# EAGLE design BandpassedGainAmpThruhole (EAGLE 9.6.2)
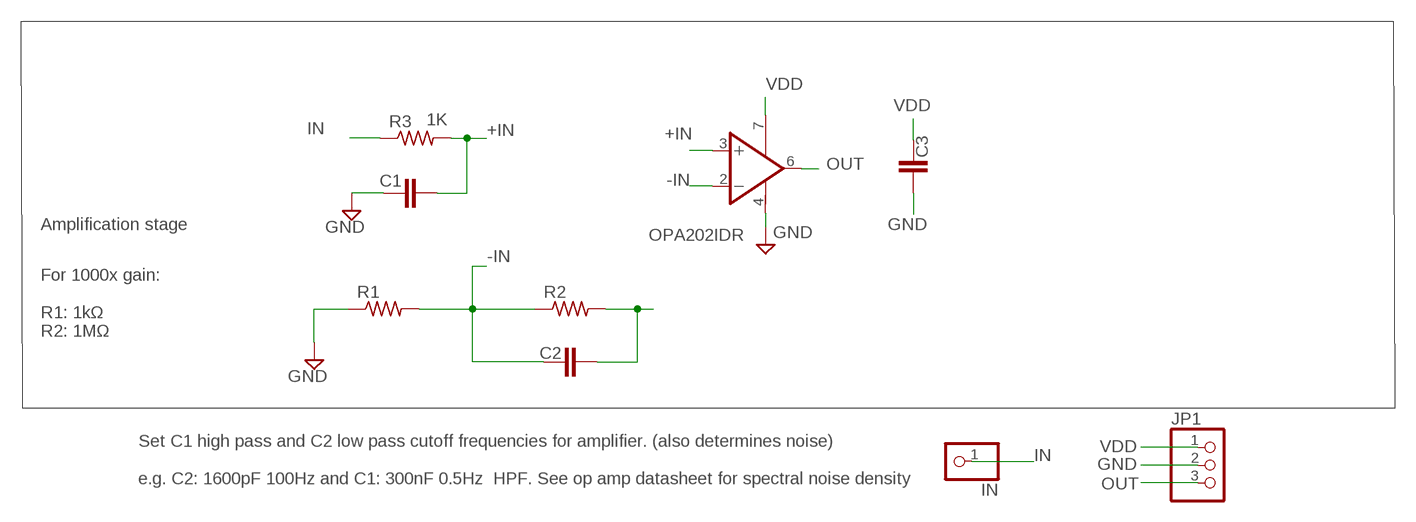
[diagram p0: schematic, sheet 1]

## Parts
C1  C2.5/2  [C2.5-2]
C2  C2.5/2  [C2.5-2]
C3  C2.5/2  [C2.5-2]
IN  PINHD-1X1  [1X01]
JP1  PINHD-1X3  [1X03]
R1  R-US_0204/5  [0204/5]
R2  R-US_0204/5  [0204/5]
R3  1K  R-US_0204/5  [0204/5]
U1  OPA202IDR  [SOIC127P600X175-8N]

## Nets
+IN: C1.2 R3.2 U1.3(A:+IN)
-IN: C2.1 R1.2 R2.1 U1.2(A:-IN)
GND: C1.1 C3.2 JP1.2 R1.1 U1.4(SUPP:V-)
IN: IN.1 R3.1
N$3: C2.2 R2.2
OUT: JP1.3 U1.6(A:OUT)
VDD: C3.1 JP1.1 U1.7(SUPP:V+)

## Notes on the sheet
- Amplification stage
- For 1000x gain:
  
  R1: 1kΩ
  R2: 1MΩ
- Set C1 high pass and C2 low pass cutoff frequencies for amplifier. (also determines noise)
  
  e.g. C2: 1600pF 100Hz and C1: 300nF 0.5Hz  HPF. See op amp datasheet for spectral noise density

## Library data of the parts
C1-C3 = capacitor-wima:C: CAPACITOR naming: grid - package width
IN = pinhead:PINHD-1X1: PIN HEADER
JP1 = pinhead:PINHD-1X3: PIN HEADER
R1-R3 = rcl:R-US_: RESISTOR, American symbol; SPICEPREFIX: R
U1 = OPA202IDR:OPA202IDR: OPAx202 Precision, Low-Noise, Heavy Capacitive Drive, 36-V Operational Amplifiers Source: Datasheet <https://www.ti.com/lit/ds/symlink/opa202.pdf?HQS=dis-dk-null-digikeymode-dsf-pf-null-wwe&ts=1654259980940&ref_url=https%253A%252F%252Fwww.ti.com%252Fgeneral%252Fdocs%252Fsuppproductinfo.tsp%253FdistId%253D10%2526gotoUrl%253Dhttps%253A%252F%252Fwww.ti.com%252Flit%252Fgpn%252Fopa202> Check availability <https://pricing.snapeda.com/parts/OPA202IDR/Texas%20Instruments/view-part?ref=eda>; AVAILABILITY: In Stock; CHECK_PRICES: https://www.snapeda.com/parts/OPA202IDR/Texas+Instruments/view-part/?ref=eda; DESCRIPTION: Low-noise (0.2 µVPP, 9 nV/√Hz) heavy-capacitive-drive (25 nF) super-beta precision op amp; MF: Texas Instruments; MP: OPA202IDR; PACKAGE: SOIC-8 Texas Instruments; PRICE: None; PURCHASE-URL: https://www.snapeda.com/api/url_track_click_mouser/?unipart_id=4806048&manufacturer=Texas Instruments&part_name=OPA202IDR&search_term=opa202; SNAPEDA_LINK: https://www.snapeda.com/parts/OPA202IDR/Texas+Instruments/view-part/?ref=snap

## Board
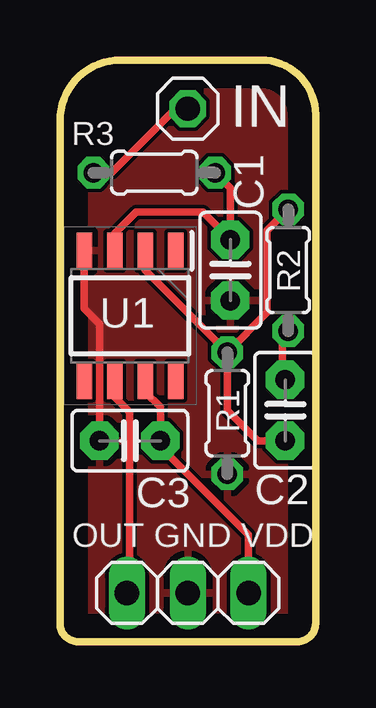
[diagram p1: board, top side]
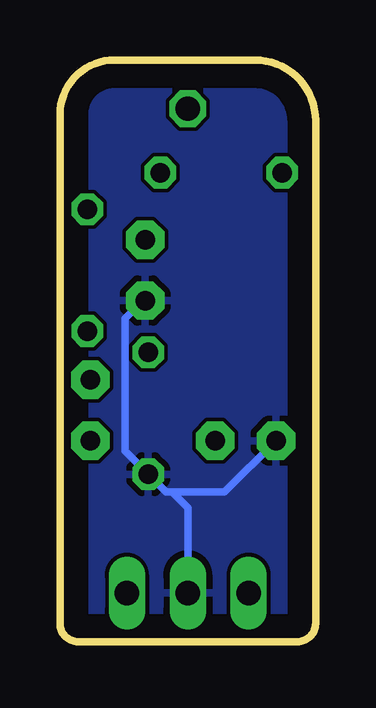
[diagram p2: board, bottom side, seen from below]

Size 10.67 x 24.26 mm. Coordinates in mm from the lower left corner, seen from the top.
Outline: 9.91,0 0.76,0 arc-90 0,0.76 0,21.72 arc-90 2.54,24.26 8.38,24.26 arc-90 10.67,21.97 10.67,0.76 arc-90 9.91,0
Copper layers (1*16): Top 0.035mm / dielectric 1.5mm / Bottom 0.035mm
Design rules "default": minimum track width 6mil, minimum drill 0.35mm, track to track 6mil, track to pad 6mil, pad to pad 6mil, via to via 6mil, smd to smd 6mil, copper to edge 40mil, drill to drill 6mil, minimum pad ring 10mil, minimum via ring 8mil, stop-mask expansion 4mil, vias tented up to drill 0mil, thermal gap 10mil

### Footprints (pad centres in the part's own frame; a part is rotated, then mirrored left to right if it is on the bottom)
C2.5-2 = drill 0.813 pad 1.6 octagon: 1 -1.27,0; 2 1.27,0
1X01 = drill 1.016 octagon: 1 0,0
1X03 = drill 1.016 long: 1 -2.54,0; 2 0,0; 3 2.54,0
0204/5 = drill 0.813 octagon: 1 -2.54,0; 2 2.54,0
SOIC127P600X175-8N = smd 1.528 x 0.65: 1 -2.711,1.905; 2 -2.711,0.635; 3 -2.711,-0.635; 4 -2.711,-1.905; 5 2.711,-1.905; 6 2.711,-0.635; 7 2.711,0.635; 8 2.711,1.905

### Placement (x,y rotation side)
C1  7.11,15.49 90 top
C2  9.4,9.65 90 top
C3  2.92,8.38 180 top
IN  5.33,22.22 0 top
JP1  5.33,2.03 180 top
R1  6.98,9.52 90 top
R2  9.53,15.49 270 top
R3  3.94,19.56 0 top
U1  2.92,13.59 270 top

### Tracks (layer width: path | path; a pad name or v marks a point on that pad's centre or on a via)
+IN
  Top 0.305: R3.2 7.11,18.92 C1.2 5.97,17.91 3.17,17.91 2.29,17.02 U1.3
-IN
  Top 0.305: R2.1 8.64,17.14 8.64,13.72 R1.2 | R1.2 3.56,15.49 U1.2 | C2.1 8.26,8.38 6.98,9.65 R1.2
GND
  Top 0.305: U1.4 1.02,13.89 1.65,13.25 C3.2
  Bottom 0.305: C1.1 7.21,14.22 7.95,13.48 7.95,7.95 R1.1 6.24,6.24 5.99,6.24 | C3.2 3.79,6.24 5.99,6.24 | 5.99,6.24 5.33,5.59 JP1.2
  pour Top: -0.89,-0.64 11.43,-0.64 11.43,25.15 -0.89,25.15
  pour Bottom: -0.64,-0.51 -0.64,25.02 11.05,25.02 11.05,-0.51
IN
  Top 0.305: IN.1 4.83,22.22 2.16,19.56 R3.1
N$3
  Top 0.305: R2.2 9.27,12.7 9.27,11.05 C2.2
OUT
  Top 0.305: U1.6 2.29,10.2 2.91,9.58 2.91,2.1 2.85,2.03 JP1.3
VDD
  Top 0.305: U1.7 3.56,10.41 4.19,9.78 C3.1 4.19,8.13 7.87,4.45 JP1.1

### Text on the board
tNames: IN | OUT GND VDD